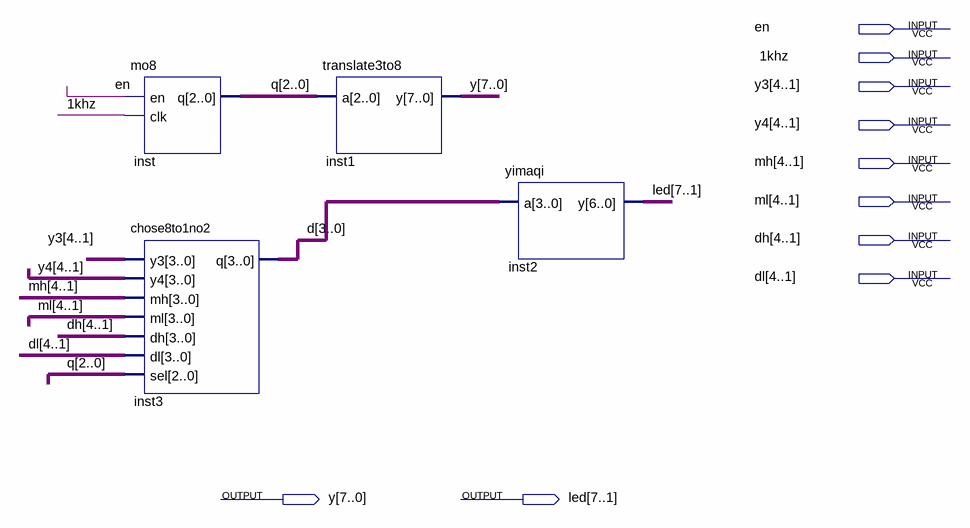
[diagram p0: schematic sheet]
// Quartus schematic xianshinianli.bdf as structural Verilog: 4 symbols, 10 pins
module xianshinianli (
  input  en,
  input  \1khz ,
  input  [4:1] y3,
  input  [4:1] y4,
  input  [4:1] mh,
  input  [4:1] ml,
  input  [4:1] dh,
  input  [4:1] dl,
  output [7:0] y,
  output [7:1] led
);

  wire [2:0] q;
  wire [3:0] d;

  mo8 inst (.en(en), .clk(\1khz ), .q(q));
  chose8to1no2 inst3 (.y3(y3), .y4(y4), .mh(mh), .ml(ml), .dh(dh), .dl(dl), .sel(q), .q(d));
  translate3to8 inst1 (.a(q), .y(y));
  yimaqi inst2 (.a(d), .y(led));
endmodule
